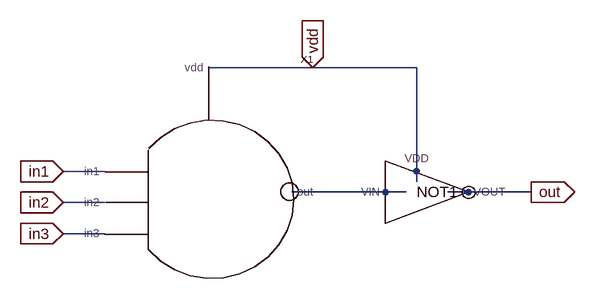
[diagram p0: schematic and3.asc]
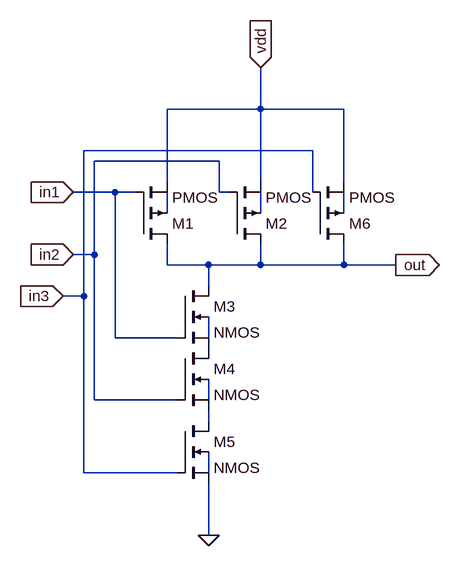
[diagram p1: sub-circuit nand3.asc]
and3.asc, the LTspice schematic file:
Version 4
SHEET 1 880 680
WIRE 160 304 0 304
WIRE 320 304 160 304
WIRE -160 464 -224 464
WIRE 320 480 320 304
WIRE 304 496 128 496
WIRE 496 496 368 496
WIRE -160 512 -224 512
WIRE -160 560 -224 560
FLAG 496 496 out
IOPIN 496 496 Out
FLAG 160 304 vdd
IOPIN 160 304 In
FLAG -224 464 in1
IOPIN -224 464 In
FLAG -224 512 in2
IOPIN -224 512 In
FLAG -224 560 in3
IOPIN -224 560 In
SYMBOL inverter 320 496 R0
WINDOW 0 0 0 Left 2
SYMATTR InstName NOT1
SYMBOL nand3 0 512 R0
SYMATTR InstName X1

nand3.asc, the sub-circuit schematic file:
Version 4
SHEET 1 880 680
WIRE 304 -16 304 -80
WIRE 304 -16 160 -16
WIRE 432 -16 304 -16
WIRE 384 48 32 48
WIRE 240 64 48 64
WIRE 160 96 160 -16
WIRE 304 96 304 -16
WIRE 432 96 432 -16
WIRE 80 112 16 112
WIRE 112 112 80 112
WIRE 240 112 240 64
WIRE 256 112 240 112
WIRE 384 112 384 48
WIRE 160 144 160 112
WIRE 304 144 304 112
WIRE 432 144 432 112
WIRE 48 208 48 64
WIRE 48 208 16 208
WIRE 160 224 160 192
WIRE 224 224 160 224
WIRE 304 224 304 192
WIRE 304 224 224 224
WIRE 432 224 432 192
WIRE 432 224 304 224
WIRE 512 224 432 224
WIRE 224 256 224 224
WIRE 32 272 32 48
WIRE 32 272 0 272
WIRE 80 336 80 112
WIRE 176 336 80 336
WIRE 224 336 224 304
WIRE 48 432 48 208
WIRE 176 432 48 432
WIRE 224 432 224 400
WIRE 224 464 224 448
WIRE 32 544 32 272
WIRE 176 544 32 544
WIRE 224 544 224 512
WIRE 224 640 224 560
FLAG 16 112 in1
IOPIN 16 112 In
FLAG 16 208 in2
IOPIN 16 208 In
FLAG 512 224 out
IOPIN 512 224 Out
FLAG 304 -80 vdd
IOPIN 304 -80 In
FLAG 224 640 0
FLAG 0 272 in3
IOPIN 0 272 In
SYMBOL pmos4 112 192 M180
SYMATTR InstName M1
SYMATTR Value2 l=90n w=400n
SYMBOL pmos4 256 192 M180
SYMATTR InstName M2
SYMATTR Value2 l=90n w=400n
SYMBOL nmos4 176 256 R0
SYMATTR InstName M3
SYMATTR Value2 l=90n w=200n
SYMBOL nmos4 176 352 R0
SYMATTR InstName M4
SYMATTR Value2 l=90n w=200n
SYMBOL nmos4 176 464 R0
SYMATTR InstName M5
SYMATTR Value2 l=90n w=200n
SYMBOL pmos4 384 192 M180
SYMATTR InstName M6
SYMATTR Value2 l=90n w=400n

The netlist it stands for:
* and3.asc
XNOT1 vdd out N001 inverter  ; pins VDD VOUT VIN
XX1 in1 in2 in3 N001 vdd nand3

* block symbol definitions
.subckt nand3 in1 in2 in3 out vdd
M1 out in1 vdd N001 PMOS l=90n w=400n
M2 out in2 vdd N002 PMOS l=90n w=400n
M3 out in1 P001 N004 NMOS l=90n w=200n
M4 P001 in2 N006 N005 NMOS l=90n w=200n
M5 N006 in3 0 N007 NMOS l=90n w=200n
M6 out in3 vdd N003 PMOS l=90n w=400n
.ends nand3

.model NMOS NMOS
.model PMOS PMOS
.lib standard.mos
.backanno
.end